# EAGLE schematic schema (EAGLE 9.6.2)
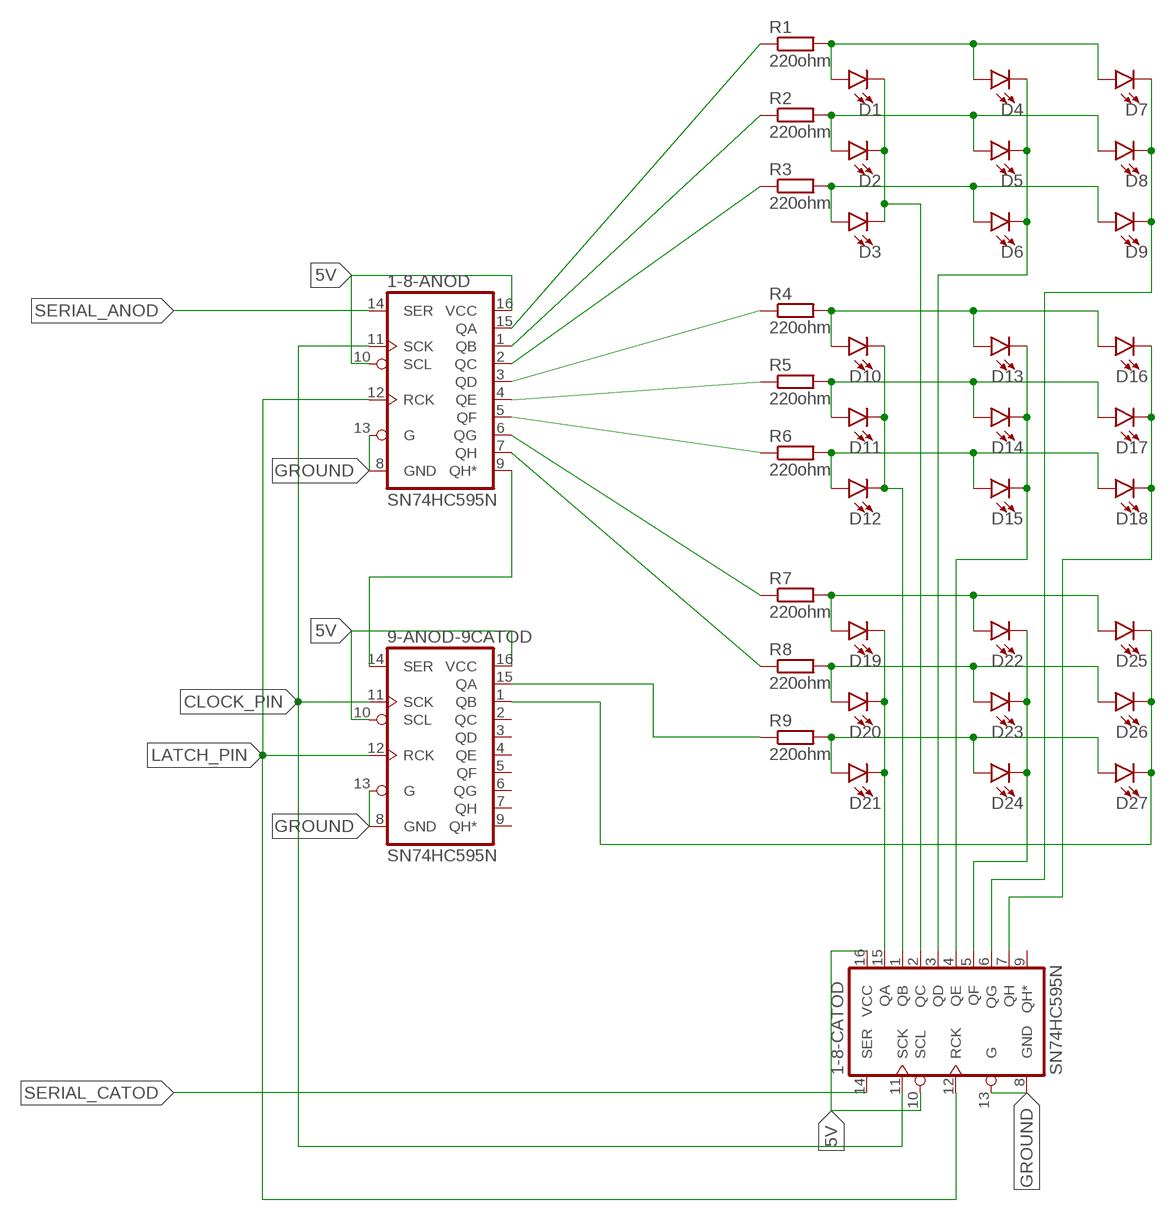
[diagram p0: schematic, sheet 1]

## Parts
1-8-ANOD  SN74HC595N  74HC595N  [DIP16]
1-8-CATOD  SN74HC595N  74HC595N  [DIP16]
9-ANOD-9CATOD  SN74HC595N  74HC595N  [DIP16]
D1  LED5MM  [LED_5MM]
D2  LED5MM  [LED_5MM]
D3  LED5MM  [LED_5MM]
D4  LED5MM  [LED_5MM]
D5  LED5MM  [LED_5MM]
D6  LED5MM  [LED_5MM]
D7  LED5MM  [LED_5MM]
D8  LED5MM  [LED_5MM]
D9  LED5MM  [LED_5MM]
D10  LED5MM  [LED_5MM]
D11  LED5MM  [LED_5MM]
D12  LED5MM  [LED_5MM]
D13  LED5MM  [LED_5MM]
D14  LED5MM  [LED_5MM]
D15  LED5MM  [LED_5MM]
D16  LED5MM  [LED_5MM]
D17  LED5MM  [LED_5MM]
D18  LED5MM  [LED_5MM]
D19  LED5MM  [LED_5MM]
D20  LED5MM  [LED_5MM]
D21  LED5MM  [LED_5MM]
D22  LED5MM  [LED_5MM]
D23  LED5MM  [LED_5MM]
D24  LED5MM  [LED_5MM]
D25  LED5MM  [LED_5MM]
D26  LED5MM  [LED_5MM]
D27  LED5MM  [LED_5MM]
R1  220ohm  R-EU_0207/10  [0207/10]
R2  220ohm  R-EU_0207/10  [0207/10]
R3  220ohm  R-EU_0207/10  [0207/10]
R4  220ohm  R-EU_0207/10  [0207/10]
R5  220ohm  R-EU_0207/10  [0207/10]
R6  220ohm  R-EU_0207/10  [0207/10]
R7  220ohm  R-EU_0207/10  [0207/10]
R8  220ohm  R-EU_0207/10  [0207/10]
R9  220ohm  R-EU_0207/10  [0207/10]

## Nets
5V: 1-8-ANOD.10(SCL) 1-8-ANOD.16(VCC) 1-8-CATOD.10(SCL) 1-8-CATOD.16(VCC) 9-ANOD-9CATOD.10(SCL) 9-ANOD-9CATOD.16(VCC)
CLOCK_PIN: 1-8-ANOD.11(SCK) 1-8-CATOD.11(SCK) 9-ANOD-9CATOD.11(SCK)
GROUND: 1-8-ANOD.8(GND) 1-8-ANOD.13(G) 1-8-CATOD.8(GND) 1-8-CATOD.13(G) 9-ANOD-9CATOD.8(GND) 9-ANOD-9CATOD.13(G)
LATCH_PIN: 1-8-ANOD.12(RCK) 1-8-CATOD.12(RCK) 9-ANOD-9CATOD.12(RCK)
N$6: D1.A D4.A D7.A R1.2
N$7: 1-8-CATOD.2(QC) D1.K(C) D2.K(C) D3.K(C)
N$9: 1-8-CATOD.6(QG) D7.K(C) D8.K(C) D9.K(C)
N$10: D2.A D5.A D8.A R2.2
N$11: D3.A D6.A D9.A R3.2
N$12: D10.A D13.A D16.A R4.2
N$13: 1-8-CATOD.1(QB) D10.K(C) D11.K(C) D12.K(C)
N$14: 1-8-CATOD.4(QE) D13.K(C) D14.K(C) D15.K(C)
N$15: 1-8-CATOD.7(QH) D16.K(C) D17.K(C) D18.K(C)
N$16: D11.A D14.A D17.A R5.2
N$17: D12.A D15.A D18.A R6.2
N$18: D19.A D22.A D25.A R7.2
N$19: 1-8-CATOD.15(QA) D19.K(C) D20.K(C) D21.K(C)
N$20: 1-8-CATOD.5(QF) D22.K(C) D23.K(C) D24.K(C)
N$21: 1-8-ANOD.9(QH*) 9-ANOD-9CATOD.14(SER)
N$22: D20.A D23.A D26.A R8.2
N$23: D21.A D24.A D27.A R9.2
N$24: 1-8-ANOD.15(QA) R1.1
N$25: 1-8-ANOD.1(QB) R2.1
N$26: 1-8-ANOD.2(QC) R3.1
N$27: 1-8-ANOD.3(QD) R4.1
N$28: 1-8-ANOD.4(QE) R5.1
N$29: 1-8-ANOD.5(QF) R6.1
N$30: 1-8-ANOD.6(QG) R7.1
N$31: 1-8-ANOD.7(QH) R8.1
N$32: 9-ANOD-9CATOD.15(QA) R9.1
N$33: 9-ANOD-9CATOD.1(QB) D25.K(C) D26.K(C) D27.K(C)
N$38: 1-8-CATOD.3(QD) D4.K(C) D5.K(C) D6.K(C)
SERIAL_ANOD: 1-8-ANOD.14(SER)
SERIAL_CATOD: 1-8-CATOD.14(SER)
Unconnected: 1-8-CATOD.9(QH*) 9-ANOD-9CATOD.2(QC) 9-ANOD-9CATOD.3(QD) 9-ANOD-9CATOD.4(QE) 9-ANOD-9CATOD.5(QF) 9-ANOD-9CATOD.6(QG) 9-ANOD-9CATOD.7(QH) 9-ANOD-9CATOD.9(QH*)

## Library data of the parts
1-8-ANOD 1-8-CATOD 9-ANOD-9CATOD = SparkFun-IC-Logic:74*595: 8-Bit Shift Register (Serial to Parallel) Datasheet <http://cdn.sparkfun.com/datasheets/BreakoutBoards/MM74HC595.pdf> SparkFun Products SparkFun Shift Register Breakout - 74HC595 <https://www.sparkfun.com/products/10680> (BOB-10680); PROD_ID: IC-13123
D1-D27 = SparkFun-LED:LED: LED (Generic) Standard schematic elements and footprints for 5mm, 3mm, 1206, and 0603 sized LEDs. Generic LEDs with no color specified.
R1-R9 = rcl:R-EU_: RESISTOR, European symbol; SPICEPREFIX: R